# Altium schematic sheet Panel_Interface.SchDoc
size B; SheetNumber: 6; SheetTotal: 16
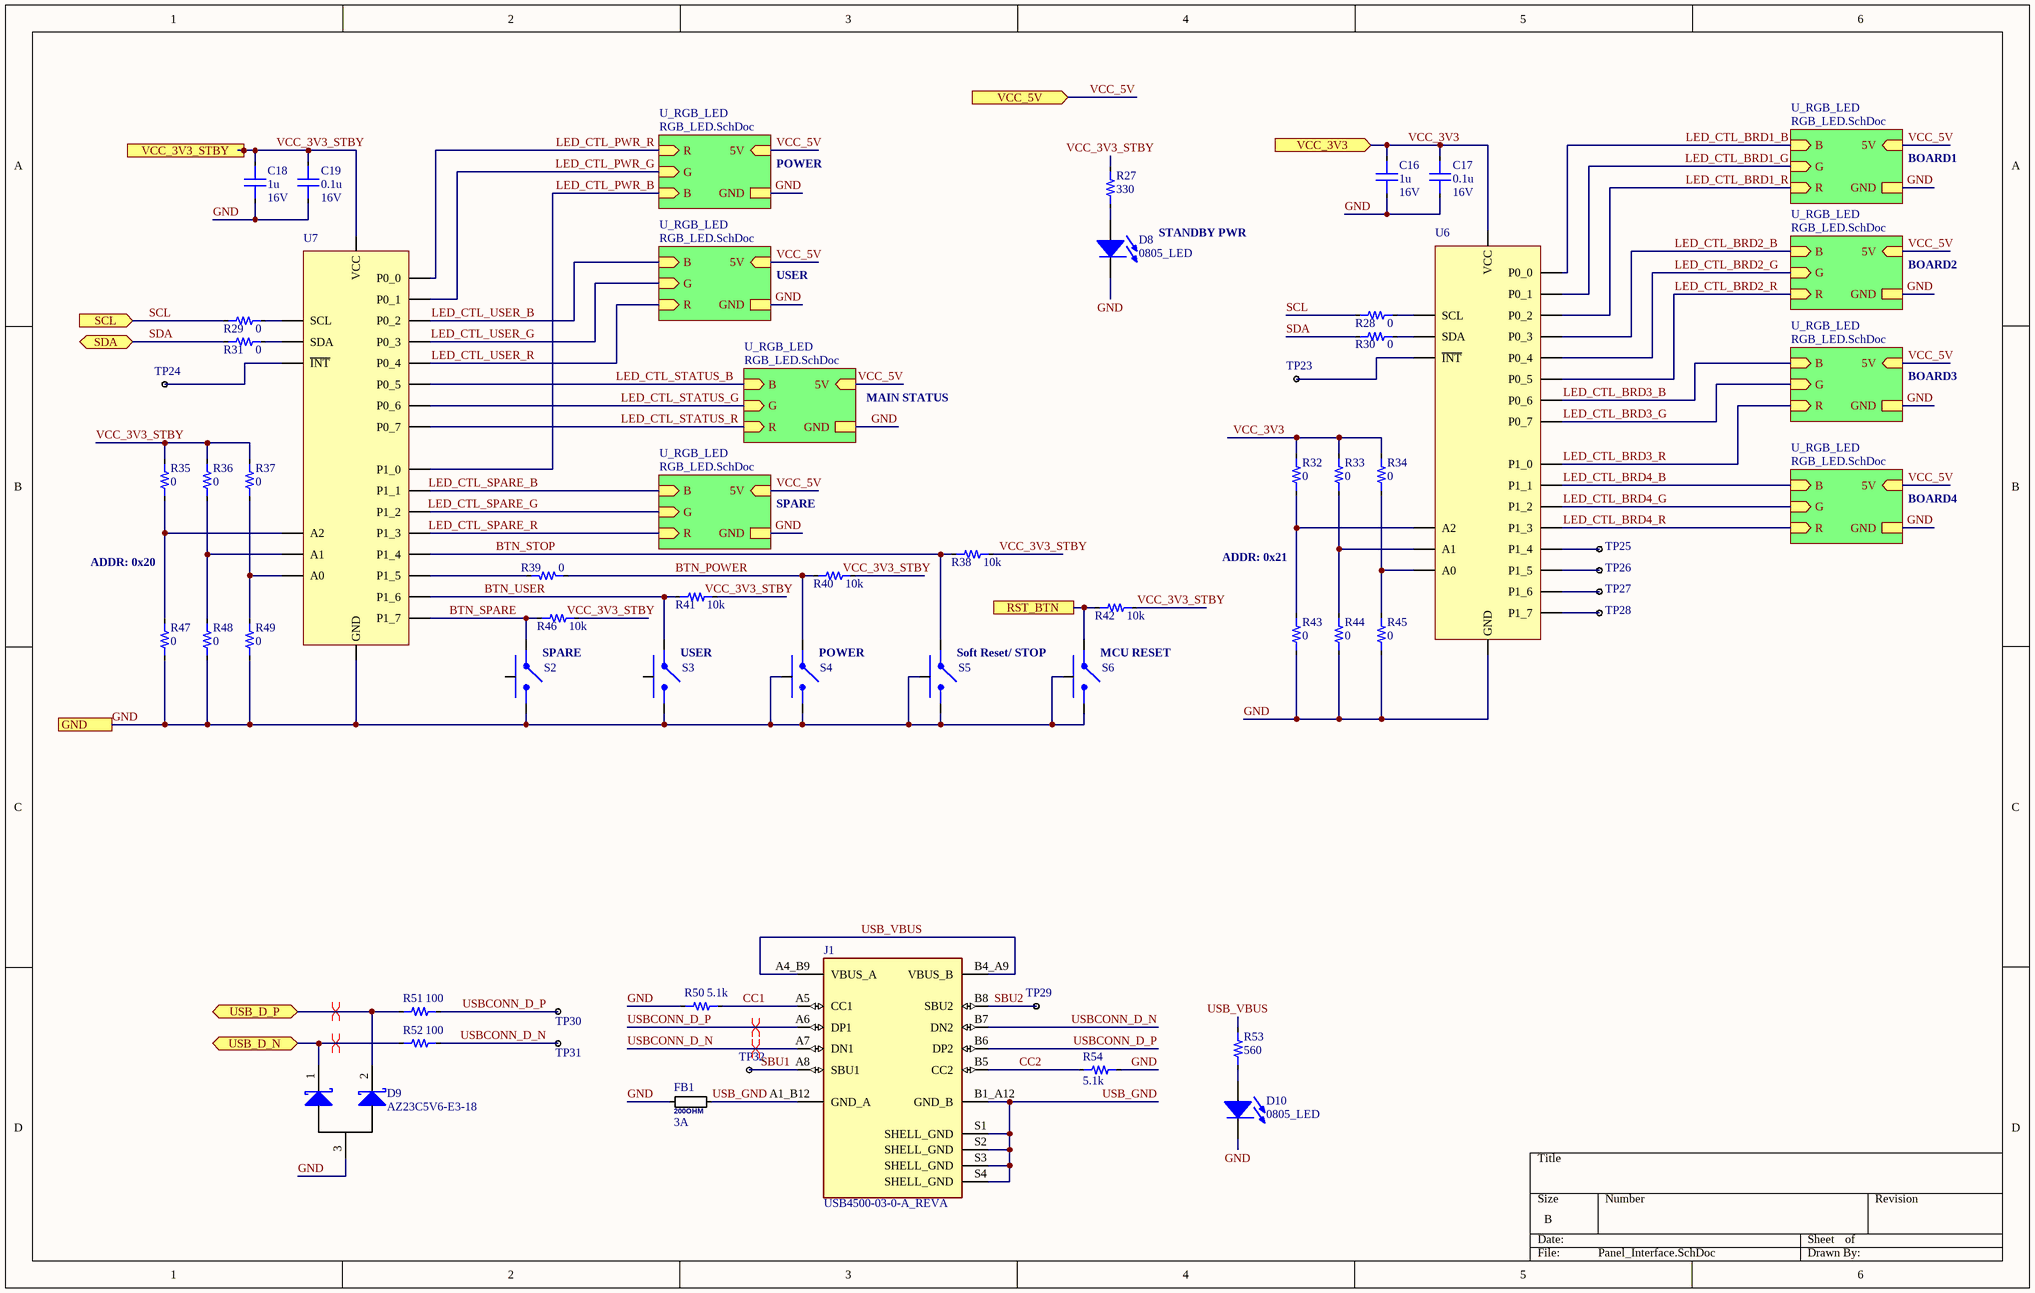
[diagram p0: Panel_Interface.SchDoc]

## Parts
C16  value 1u  Voltage: 16V  [0603_CAP]  (hidden comment: Capacitor)
C17  value 0.1u  Voltage: 16V  [0603_CAP]  (hidden comment: Capacitor)
C18  value 1u  Voltage: 16V  [0603_CAP]  (hidden comment: Capacitor)
C19  value 0.1u  Voltage: 16V  [0603_CAP]  (hidden comment: Capacitor)
D8  0805_LED  [0805_LED]
D9  AZ23C5V6-E3-18  [SOT23-3]
D10  0805_LED  [0805_LED]
FB1  =Z@100MHz: 200OHM  iMax: 3A  [0805_Ferrite]  (hidden comment: *)
J1  USB4500-03-0-A_REVA  [GCT_USB4500-03-0-A_REVA]
R27  value 330  [0603_RES]  (hidden comment: Resistor)
R28  value 0  [0603_RES]  (hidden comment: Resistor)
R29  value 0  [0603_RES]  (hidden comment: Resistor)
R30  value 0  [0603_RES]  (hidden comment: Resistor)
R31  value 0  [0603_RES]  (hidden comment: Resistor)
R32  value 0  [0603_RES]  (hidden comment: Resistor)
R33  value 0  [0603_RES]  (hidden comment: Resistor)
R34  value 0  [0603_RES]  (hidden comment: Resistor)
R35  value 0  [0603_RES]  (hidden comment: Resistor)
R36  value 0  [0603_RES]  (hidden comment: Resistor)
R37  value 0  [0603_RES]  (hidden comment: Resistor)
R38  value 10k  [0603_RES]  (hidden comment: Resistor)
R39  value 0  [0603_RES]  (hidden comment: Resistor)
R40  value 10k  [0603_RES]  (hidden comment: Resistor)
R41  value 10k  [0603_RES]  (hidden comment: Resistor)
R42  value 10k  [0603_RES]  (hidden comment: Resistor)
R43  value 0  [0603_RES]  (hidden comment: Resistor)
R44  value 0  [0603_RES]  (hidden comment: Resistor)
R45  value 0  [0603_RES]  (hidden comment: Resistor)
R46  value 10k  [0603_RES]  (hidden comment: Resistor)
R47  value 0  [0603_RES]  (hidden comment: Resistor)
R48  value 0  [0603_RES]  (hidden comment: Resistor)
R49  value 0  [0603_RES]  (hidden comment: Resistor)
R50  value 5.1k  [0603_RES]  (hidden comment: Resistor)
R51  value 100  [0603_RES]  (hidden comment: Resistor)
R52  value 100  [0603_RES]  (hidden comment: Resistor)
R53  value 560  [0603_RES]  (hidden comment: Resistor)
R54  value 5.1k  [0603_RES]  (hidden comment: Resistor)
S2  PTS645V  [PTS645V]  (value not drawn)
S3  PTS645V  [PTS645V]  (value not drawn)
S4  PTS645V  [PTS645V]  (value not drawn)
S5  PTS645V  [PTS645V]  (value not drawn)
S6  PTS645V  [PTS645V]  (value not drawn)
TP23  1mm Testpoint  [1mm_testpoint]  (value not drawn)
TP24  1mm Testpoint  [1mm_testpoint]  (value not drawn)
TP25  1mm Testpoint  [1mm_testpoint]  (value not drawn)
TP26  1mm Testpoint  [1mm_testpoint]  (value not drawn)
TP27  1mm Testpoint  [1mm_testpoint]  (value not drawn)
TP28  1mm Testpoint  [1mm_testpoint]  (value not drawn)
TP29  1mm Testpoint  [1mm_testpoint]  (value not drawn)
TP30  1mm Testpoint  [1mm_testpoint]  (value not drawn)
TP31  1mm Testpoint  [1mm_testpoint]  (value not drawn)
TP32  1mm Testpoint  [1mm_testpoint]  (value not drawn)
U6  NCA9535-Q100  [TSSOP-24. 4.4mm width]  (value not drawn)
U7  NCA9535-Q100  [TSSOP-24. 4.4mm width]  (value not drawn)

## Sub-sheets
U_RGB_LED = RGB_LED.SchDoc: 5V (in), B (in), G (in), R (in), GND
U_RGB_LED = RGB_LED.SchDoc: 5V (in), B (in), G (in), R (in), GND
U_RGB_LED = RGB_LED.SchDoc: 5V (in), B (in), G (in), R (in), GND
U_RGB_LED = RGB_LED.SchDoc: 5V (in), B (in), G (in), R (in), GND
U_RGB_LED = RGB_LED.SchDoc: 5V (in), B (in), G (in), R (in), GND
U_RGB_LED = RGB_LED.SchDoc: 5V (in), B (in), G (in), R (in), GND
U_RGB_LED = RGB_LED.SchDoc: 5V (in), B (in), G (in), R (in), GND
U_RGB_LED = RGB_LED.SchDoc: 5V (in), B (in), G (in), R (in), GND

## Ports
GND, RST_BTN, SCL (in), SDA (bidir), USB_D_N (bidir), USB_D_P (bidir), VCC_3V3 (in), VCC_3V3_STBY (in), VCC_5V (in)

## Nets
BTN_POWER: R39.1 R40.1 S4.1
BTN_SPARE: R46.1 S2.1 U7.20(P1_7)
BTN_STOP: R38.1 S5.1 U7.17(P1_4)
BTN_USER: R41.1 S3.1 U7.19(P1_6)
CC1: J1.A5(CC1) R50.2
CC2: J1.B5(CC2) R54.1
GND: C16.1 C17.1 C18.1 C19.1 D8.2(K) D9.3 D10.2(K) FB1.1 R43.1 R44.1 R45.1 R47.1 R48.1 R49.1 R50.1 R54.2 S2.2 S3.2 S4.2 S4.TAB S5.2 S5.TAB S6.2 S6.TAB U6.12(GND) U7.12(GND) ; port GND, sheet U_RGB_LED/GND, sheet U_RGB_LED/GND, sheet U_RGB_LED/GND, sheet U_RGB_LED/GND, sheet U_RGB_LED/GND, sheet U_RGB_LED/GND, sheet U_RGB_LED/GND, sheet U_RGB_LED/GND
LED_CTL_BRD1_B: U6.4(P0_0) ; sheet U_RGB_LED/B
LED_CTL_BRD1_G: U6.5(P0_1) ; sheet U_RGB_LED/G
LED_CTL_BRD1_R: U6.6(P0_2) ; sheet U_RGB_LED/R
LED_CTL_BRD2_B: U6.7(P0_3) ; sheet U_RGB_LED/B
LED_CTL_BRD2_G: U6.8(P0_4) ; sheet U_RGB_LED/G
LED_CTL_BRD2_R: U6.9(P0_5) ; sheet U_RGB_LED/R
LED_CTL_BRD3_B: U6.10(P0_6) ; sheet U_RGB_LED/B
LED_CTL_BRD3_G: U6.11(P0_7) ; sheet U_RGB_LED/G
LED_CTL_BRD3_R: U6.13(P1_0) ; sheet U_RGB_LED/R
LED_CTL_BRD4_B: U6.14(P1_1) ; sheet U_RGB_LED/B
LED_CTL_BRD4_G: U6.15(P1_2) ; sheet U_RGB_LED/G
LED_CTL_BRD4_R: U6.16(P1_3) ; sheet U_RGB_LED/R
LED_CTL_PWR_B: U7.13(P1_0) ; sheet U_RGB_LED/B
LED_CTL_PWR_G: U7.5(P0_1) ; sheet U_RGB_LED/G
LED_CTL_PWR_R: U7.4(P0_0) ; sheet U_RGB_LED/R
LED_CTL_SPARE_B: U7.14(P1_1) ; sheet U_RGB_LED/B
LED_CTL_SPARE_G: U7.15(P1_2) ; sheet U_RGB_LED/G
LED_CTL_SPARE_R: U7.16(P1_3) ; sheet U_RGB_LED/R
LED_CTL_STATUS_B: U7.9(P0_5) ; sheet U_RGB_LED/B
LED_CTL_STATUS_G: U7.10(P0_6) ; sheet U_RGB_LED/G
LED_CTL_STATUS_R: U7.11(P0_7) ; sheet U_RGB_LED/R
LED_CTL_USER_B: U7.6(P0_2) ; sheet U_RGB_LED/B
LED_CTL_USER_G: U7.7(P0_3) ; sheet U_RGB_LED/G
LED_CTL_USER_R: U7.8(P0_4) ; sheet U_RGB_LED/R
RST_BTN: R42.1 S6.1 ; port RST_BTN
SBU1: J1.A8(SBU1) TP32.1
SBU2: J1.B8(SBU2) TP29.1
SCL: R28.1 R29.1 ; port SCL
SDA: R30.1 R31.1 ; port SDA
USB_D_N: D9.1 R52.1 ; port USB_D_N
USB_D_P: D9.2 R51.1 ; port USB_D_P
USB_GND: FB1.2 J1.A1_B12(GND_A) J1.B1_A12(GND_B) J1.S1(SHELL_GND) J1.S2(SHELL_GND) J1.S3(SHELL_GND) J1.S4(SHELL_GND)
USB_VBUS: J1.A4_B9(VBUS_A) J1.B4_A9(VBUS_B) R53.2
USBCONN_D_N: J1.A7(DN1) J1.B7(DN2) R52.2 TP31.1
USBCONN_D_P: J1.A6(DP1) J1.B6(DP2) R51.2 TP30.1
VCC_3V3: C16.2 C17.2 R32.2 R33.2 R34.2 U6.24(VCC) ; port VCC_3V3
VCC_3V3_STBY: C18.2 C19.2 R27.2 R35.2 R36.2 R37.2 R38.2 R40.2 R41.2 R42.2 R46.2 U7.24(VCC) ; port VCC_3V3_STBY
VCC_5V: port VCC_5V, sheet U_RGB_LED/5V, sheet U_RGB_LED/5V, sheet U_RGB_LED/5V, sheet U_RGB_LED/5V, sheet U_RGB_LED/5V, sheet U_RGB_LED/5V, sheet U_RGB_LED/5V, sheet U_RGB_LED/5V
NetD8_1: D8.1(A) R27.1
NetD10_1: D10.1(A) R53.1
NetR28_2: R28.2 U6.22(SCL)
NetR29_2: R29.2 U7.22(SCL)
NetR30_2: R30.2 U6.23(SDA)
NetR31_2: R31.2 U7.23(SDA)
NetR32_1: R32.1 R43.2 U6.3(A2)
NetR33_1: R33.1 R44.2 U6.2(A1)
NetR34_1: R34.1 R45.2 U6.21(A0)
NetR35_1: R35.1 R47.2 U7.3(A2)
NetR36_1: R36.1 R48.2 U7.2(A1)
NetR37_1: R37.1 R49.2 U7.21(A0)
NetR39_2: R39.2 U7.18(P1_5)
NetTP23_1: TP23.1 U6.1(~{INT})
NetTP24_1: TP24.1 U7.1(~{INT})
NetTP25_1: TP25.1 U6.17(P1_4)
NetTP26_1: TP26.1 U6.18(P1_5)
NetTP27_1: TP27.1 U6.19(P1_6)
NetTP28_1: TP28.1 U6.20(P1_7)

Not connected (* = marked no-connect by the designer): S2 TAB; S3 TAB

## Layout directives
differential pair: USB_D_N, USB_D_P, USBCONN_D_N, USBCONN_D_P

## Notes on the sheet
- POWER
- BOARD1
- STANDBY PWR
- USER
- BOARD2
- MAIN STATUS
- BOARD3
- BOARD4
- ADDR: 0x20
- SPARE
- ADDR: 0x21
- (near S2) SPARE
- (near S3) USER
- (near S4) POWER
- Soft Reset/ STOP
- (near S6) MCU RESET

## Library data of the parts
D8 = 0805_LED: Generic 0805 LED; Color: Orange
D9 = AZ23C5V6-E3-18: Zener Diode Array 1 Pair Common Anode 5.6 V 300 mW ±7% SOT-23-3; ComponentLink1Description: Datasheet; ComponentLink1URL: https://www.vishay.com/docs/86340/az23_series.pdf; ComponentLink2Description: Digikey; ComponentLink2URL: https://www.digikey.com/en/products/detail/vishay-general-semiconductor-diodes-division/AZ23C5V6-E3-18/3104165
D10 = 0805_LED: Generic 0805 LED; Color: Green
FB1 = ChipFerrite: Link: *; MfrPartNo: *; Name: *; Resistance: *; Package: *; Inductance: *
J1 = USB4500-03-0-A_REVA: Type C USB 2.0 Connector; MF: Global Connector Technology; MP: USB4500-03-0-A; SnapEDA_Link: https://www.snapeda.com/parts/USB4500-03-0-A/Global%20Connector%20Technology/view-part/6577171/?ref=snap; Availability: No availability data; Check_prices: https://www.snapeda.com/parts/USB4500-03-0-A/Global%20Connector%20Technology/view-part/6577171/?ref=eda; Package: None; Price: None; Value: *
S2-S6 = PTS645V: Tactile Switch SPST-NO Side Actuated Surface Mount, Right Angle; Current: 0.05A; MaxVoltage: 12V; Pole: 1; Name: PTS645V; Mounting: SMD; ComponentLink1Description: Digikey; ComponentLink1URL: https://www.digikey.com/en/products/detail/c-k/PTS645SH95-2-LFS/1146763
TP23-TP32 = 1mm Testpoint: 1mm test point; ComponentLink1Description: Digikey; ComponentLink1URL: https://www.digikey.com/product-detail/en/te-connectivity-amp-connectors/RCU-0C/A106145CT-ND/3477802
U6 U7 = NCA9535-Q100: I/O Expander 16 I2C, SMBus 400 kHz 24-TSSOP; ComponentLink1Description: Digikey; ComponentLink1URL: https://www.digikey.com/en/products/detail/nexperia-usa-inc/NCA9535PW-Q100J/19109486
C16-C19 = Capacitor: Dielectric: *; Percent Tolerance: *; ESR: *
R27-R54 = Resistor: Tolerance: *